# EasyEDA Pro project ProPrj_2024省综合药丸抓取省赛_2025-04-10.epro

# Schematic Schematic1
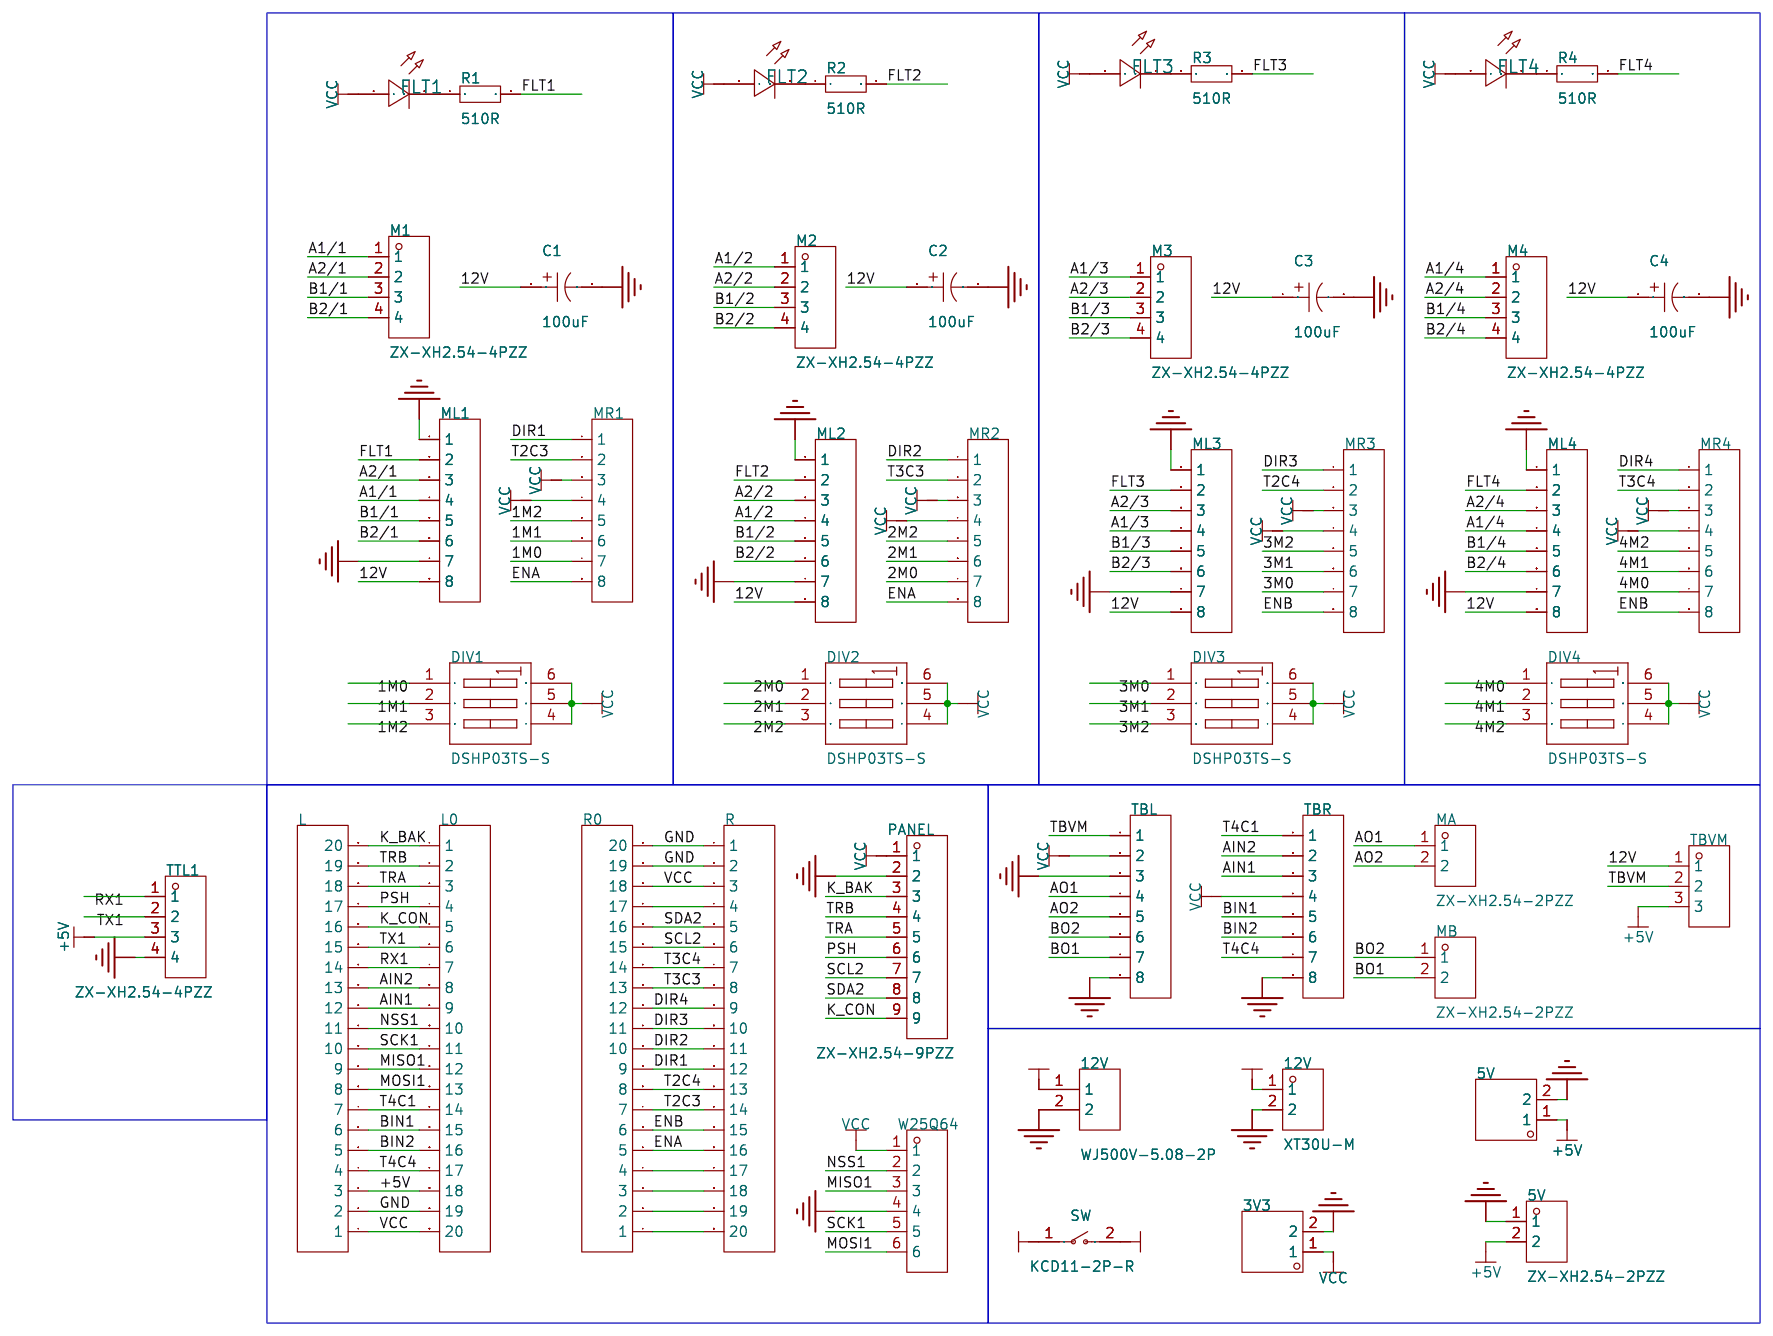
[diagram p0: schematic sheet]

## Parts
3V3  -  [HDR-TH_2P-P2.54-V-M-1]
5V  ZX-XH2.54-2PZZ  [CONN-TH_2P-P2.50_HX25003-2A]
5V#2  -  [HDR-TH_2P-P2.54-V-M-1]
12V  WJ500V-5.08-2P  [CONN-TH_2P-P5.00_WJ500V-5.08-2P]
12V#2  XT30U-M  [CONN-TH_XT30U-M]
C1  100uF  [CAP-SMD_BD6.3-L6.6-W6.6-LS7.6-FD-1]
C2  100uF  [CAP-SMD_BD6.3-L6.6-W6.6-LS7.6-FD-1]
C3  100uF  [CAP-SMD_BD6.3-L6.6-W6.6-LS7.6-FD-1]
C4  100uF  [CAP-SMD_BD6.3-L6.6-W6.6-LS7.6-FD-1]
DIV1  DSHP03TS-S  [SW-SMD_DSHP03TS-S]
DIV2  DSHP03TS-S  [SW-SMD_DSHP03TS-S]
DIV3  DSHP03TS-S  [SW-SMD_DSHP03TS-S]
DIV4  DSHP03TS-S  [SW-SMD_DSHP03TS-S]
FLT1  -  [LED_0603]
FLT2  -  [LED_0603]
FLT3  -  [LED_0603]
FLT4  -  [LED_0603]
L  -  [HDR-TH_20P-P2.54-V-F]
L0  -  [HDR-TH_20P-P2.54-V-F]
M1  ZX-XH2.54-4PZZ  [CONN-TH_4P-P2.50_4PIN]
M2  ZX-XH2.54-4PZZ  [CONN-TH_4P-P2.50_4PIN]
M3  ZX-XH2.54-4PZZ  [CONN-TH_4P-P2.50_4PIN]
M4  ZX-XH2.54-4PZZ  [CONN-TH_4P-P2.50_4PIN]
MA  ZX-XH2.54-2PZZ  [CONN-TH_2P-P2.50_HX25003-2A]
MB  ZX-XH2.54-2PZZ  [CONN-TH_2P-P2.50_HX25003-2A]
ML1  -  [HDR-TH_8P-P2.54-V-F-1]
ML2  -  [HDR-TH_8P-P2.54-V-F-1]
ML3  -  [HDR-TH_8P-P2.54-V-F-1]
ML4  -  [HDR-TH_8P-P2.54-V-F-1]
MR1  -  [HDR-TH_8P-P2.54-V-F-1]
MR2  -  [HDR-TH_8P-P2.54-V-F-1]
MR3  -  [HDR-TH_8P-P2.54-V-F-1]
MR4  -  [HDR-TH_8P-P2.54-V-F-1]
PANEL  ZX-XH2.54-9PZZ  [CONN-TH_9P-P2.50_ZX-XH2.54-9PZZ]
R  -  [HDR-TH_20P-P2.54-V-F]
R0  -  [HDR-TH_20P-P2.54-V-F]
R1  510R  [R0603]
R2  510R  [R0603]
R3  510R  [R0603]
R4  510R  [R0603]
SW  KCD11-2P-R  [SW-TH_2P-L15.0-W10.5-P5.00_KCD11-2P-R]
TBL  -  [HDR-TH_8P-P2.54-V-F-1]
TBR  -  [HDR-TH_8P-P2.54-V-F-1]
TBVM  -  [HDR-TH_3P-P2.54-V-M]
TTL1  ZX-XH2.54-4PZZ  [CONN-TH_4P-P2.50_4PIN]
W25Q64  -  [HDR-TH_6P-P2.54-V-F]

## Library data of the parts
3V3 5V#2 = HDR-M_2.54_1x2P: Supplier Part: C124375; Supplier Footprint: 插件
5V MA MB = ZX-XH2.54-2PZZ: 插针结构:1x2P;间距:2.54mm;安装方式:直插;参考系列:XH;总PIN数:2P;排数:1;每排PIN数:2;行距:-;额定电流:3A;触头材质:黄铜;触头镀层:锡;工作温度范围:-25℃~+85℃;; Supplier Part: C7429632; Manufacturer: Megastar(兆星); Supplier Footprint: 插件,P=2.54mm; JLCPCB Part Class: 扩展库; Datasheet: https://atta.szlcsc.com/upload/public/pdf/source/20230619/19BA6947230AA44A04D3EDD65E618FD0.pdf; Supplier: LCSC; Pins Structure: 1x2P; Pitch: 2.54mm; Mounting Style: 直插; Reference Series: XH; Number of Pins: 2P; Number of Rows: 1; Number of PINs Per Row: 2; Current Rating (Max): 3A; Contact Material: 黄铜; Contact Plating: 锡; Operating Temperature Range: -25℃~+85℃
12V = WJ500V-5.08-2P: 结构:1x2P;间距:5.08mm;颜色:绿色;安装方式:直插;额定电流:18A;额定电压:250V;排数:1;线规 - AWG:14~30;线规 - 平方毫米:2.5;每排PIN数:2;触头材质:-;触头镀层:-;工作温度范围:-40℃~+105℃;焊接温度(最大值):-;; LCSC Part Name: 1x2P 5.08mm 直插 排数:1 每排P数:2; Supplier Part: C8465; Manufacturer: KANGNEX(康奈克斯电气); Supplier Footprint: 插件,P=5.08mm; JLCPCB Part Class: 扩展库; Datasheet: https://atta.szlcsc.com/upload/public/pdf/source/20191225/C8465_02D34CE5B5B4A53DF5891601D97FA9F4.pdf; Supplier: LCSC; Structure: 1x2P; Pitch: 5.08mm; Color: 绿色; Mounting Style: 直插; Current Rating (Max): 18A; Voltage Rating (Max): 250V; Number of Pins: 2P; Number of Rows: 1; Wire Gauge - AWG: 14~30; Wire Gauge - mm2: 2.5; Number of PINs Per Row: 2; Operating Temperature Range: -40℃~+105℃; Screw Specification: M2.5
12V#2 = XT30U-M: 类别:-;类型1:-;; LCSC Part Name: AMASS(艾迈斯)轻量版锂电池插头公头 XT30U-M; Supplier Part: C99101; Manufacturer: AMASS(艾迈斯); JLCPCB Part Class: 扩展库; Datasheet: https://atta.szlcsc.com/upload/public/pdf/source/20170606/1496716542582.pdf; Supplier: LCSC; Brand: 艾迈斯; Type: 插头; Colour: 黄色; InterfaceType: 公头
C1-C4 = RVE100UF35V67RV0072: 容值:100uF;精度:±20%;额定电压:35V;纹波电流:230mA@120Hz;等效串联电阻:600mΩ@100kHz;; LCSC Part Name: 100uF ±20% 35V; Supplier Part: C2836437; Manufacturer: KNSCHA(科尼盛); Supplier Footprint: SMD,D6.3xL7.7mm; JLCPCB Part Class: 扩展库; Datasheet: https://atta.szlcsc.com/upload/public/pdf/source/20220719/B52EB46F8A1558448ED03D8B4CB3C24F.pdf; Supplier: LCSC; Tolerance: ±20%; Rated Voltage: 35V; Ripple Current: 230mA@120Hz; Equivalent Series Resistance(ESR): 600mΩ@100kHz; φD: 6.3mm; L: 7.7mm; Lifetime @ Temp: 2000hrs@105℃; Operating Temperature: -55℃~+105℃
DIV1-DIV4 = DSHP03TS-S: 类型:平拨,凹槽式;电路结构:单刀单掷;开关位数:3位;额定电流:25mA;额定电压:24V;使用寿命:3千次;颜色:黑色;; LCSC Part Name: 间距1.27mm 平拨,凹槽式 3位拨码开关; Supplier Part: C319051; Manufacturer: XKB Connectivity(中国星坤); Supplier Footprint: SMD-6P,5.4x5.4mm; JLCPCB Part Class: 扩展库; Datasheet: https://atta.szlcsc.com/upload/public/pdf/source/20211009/11BE85C99D2C85B0991AF4F9D6EB8BDE.pdf; Supplier: LCSC; Type: 平拨,凹槽式; Circuit: 单刀单掷; Number of Positions: 3位; Pin Style: 鸥翼型; Lead Pitch: 1.27mm; Current Rating: 25mA; Voltage Rating: 24V; Operating Temperature: -20℃~+70℃; Operating Life: 3千次; Color: 黑色
FLT1-FLT4 = LED_0603-R: Supplier Footprint: 0603
L L0 R R0 = HDR-F_2.54_1x20P: Supplier Part: C50984; Supplier Footprint: 插件
M1-M4 TTL1 = ZX-XH2.54-4PZZ: 插针结构:1x4P;间距:2.54mm;安装方式:直插;参考系列:XH;总PIN数:4P;排数:1;每排PIN数:4;行距:-;额定电流:3A;触头材质:黄铜;触头镀层:锡;工作温度范围:-25℃~+85℃;; Supplier Part: C7429634; Manufacturer: Megastar(兆星); Supplier Footprint: 插件,P=2.54mm; JLCPCB Part Class: 扩展库; Datasheet: https://atta.szlcsc.com/upload/public/pdf/source/20230619/B529A2163E0159A644AB3383D208FB03.pdf; Supplier: LCSC; Pins Structure: 1x4P; Pitch: 2.54mm; Mounting Style: 直插; Reference Series: XH; Number of Pins: 4P; Number of Rows: 1; Number of PINs Per Row: 4; Current Rating (Max): 3A; Contact Material: 黄铜; Contact Plating: 锡; Operating Temperature Range: -25℃~+85℃
ML1-ML4 MR1-MR4 TBL TBR = HDR-F_2.54_1x8P: Supplier Part: C27438; Supplier Footprint: 插件
PANEL = ZX-XH2.54-9PZZ: 插针结构:1x9P;间距:2.54mm;安装方式:直插;参考系列:XH;总PIN数:9P;排数:1;每排PIN数:9;行距:-;额定电流:3A;触头材质:黄铜;触头镀层:锡;工作温度范围:-25℃~+85℃;; Supplier Part: C7429639; Manufacturer: Megastar(兆星); Supplier Footprint: 插件,P=2.54mm; JLCPCB Part Class: 扩展库; Datasheet: https://atta.szlcsc.com/upload/public/pdf/source/20230619/A41EC9057C60B306F9C507100E2CF652.pdf; Supplier: LCSC; Pins Structure: 1x9P; Pitch: 2.54mm; Mounting Style: 直插; Reference Series: XH; Number of Pins: 9P; Number of Rows: 1; Number of PINs Per Row: 9; Current Rating (Max): 3A; Contact Material: 黄铜; Contact Plating: 锡; Operating Temperature Range: -25℃~+85℃
R1-R4 = Res_0603: Supplier Footprint: 0603
SW = KCD11-2P-R: 带灯:无;引脚样式:焊片;额定电流:3A;额定电压(AC):250V;额定电压(DC):-;电路结构:单刀单掷;机械寿命:1万次;; LCSC Part Name: 10.5*15mm 两脚两档跷板开关 红钮; Supplier Part: C5884414; Manufacturer: SHOU HAN(首韩); Supplier Footprint: 插件; JLCPCB Part Class: 扩展库; Datasheet: https://atta.szlcsc.com/upload/public/pdf/source/20230506/CD06DFDE35C8048D34175BFF4AF6A2C2.pdf; Supplier: LCSC; Switch Length: 15mm; Switch Width: 10.5mm; Switch Height: 17.2mm; Actuator Type: 凹面弯曲; With Lamp: 无; Pin Style: 焊片; Actuator Color: 红色; Contact Current: 3A; Voltage Rating (AC): 250V; Circuit: 单刀单掷; Mechanical Life: 1万次; Operating Temperature: 0℃~+125℃; Actuator Identifier: - O
TBVM = HDR-M_2.54_1x3P: Supplier Part: C2937625; Supplier Footprint: 插件
W25Q64 = HDR-F_2.54_1x6P: Supplier Part: C40877; Supplier Footprint: 插件

## Nets
12V: C1.1 C2.1 C3.1 C4.1 ML1.8 ML2.8 ML3.8 ML4.8 SW.1 TBVM.1
+5V: 5V.2 5V#2.1 L.3 L0.18 TBVM.3 TTL1.3
GND: 3V3.2 5V.1 5V#2.2 12V.2 12V#2.2 C1.2 C2.2 C3.2 C4.2 L.2 L0.19 ML1.1 ML1.7 ML2.1 ML2.7 ML3.1 ML3.7 ML4.1 ML4.7 PANEL.2 R.1 R.2 R0.19 R0.20 TBL.3 TBL.8 TBR.8 TTL1.4 W25Q64.4
VCC: 3V3.1 DIV1.4 DIV1.5 DIV1.6 DIV2.4 DIV2.5 DIV2.6 DIV3.4 DIV3.5 DIV3.6 DIV4.4 DIV4.5 DIV4.6 FLT1.2(A) FLT2.2(A) FLT3.2(A) FLT4.2(A) L.1 L0.20 MR1.3 MR1.4 MR2.3 MR2.4 MR3.3 MR3.4 MR4.3 MR4.4 PANEL.1 R.3 R0.18 TBL.2 TBR.4 W25Q64.1
1M0: DIV1.1 MR1.7
1M1: DIV1.2 MR1.6
1M2: DIV1.3 MR1.5
2M0: DIV2.1 MR2.7
2M1: DIV2.2 MR2.6
2M2: DIV2.3 MR2.5
3M0: DIV3.1 MR3.7
3M1: DIV3.2 MR3.6
3M2: DIV3.3 MR3.5
4M0: DIV4.1 MR4.7
4M1: DIV4.2 MR4.6
4M2: DIV4.3 MR4.5
A1/1: M1.1 ML1.4
A1/2: M2.1 ML2.4
A1/3: M3.1 ML3.4
A1/4: M4.1 ML4.4
A2/1: M1.2 ML1.3
A2/2: M2.2 ML2.3
A2/3: M3.2 ML3.3
A2/4: M4.2 ML4.3
AIN1: L.12 L0.9 TBR.3
AIN2: L.13 L0.8 TBR.2
AO1: MA.1 TBL.4
AO2: MA.2 TBL.5
B1/1: M1.3 ML1.5
B1/2: M2.3 ML2.5
B1/3: M3.3 ML3.5
B1/4: M4.3 ML4.5
B2/1: M1.4 ML1.6
B2/2: M2.4 ML2.6
B2/3: M3.4 ML3.6
B2/4: M4.4 ML4.6
BIN1: L.6 L0.15 TBR.5
BIN2: L.5 L0.16 TBR.6
BO1: MB.2 TBL.7
BO2: MB.1 TBL.6
DIR1: MR1.1 R.12 R0.9
DIR2: MR2.1 R.11 R0.10
DIR3: MR3.1 R.10 R0.11
DIR4: MR4.1 R.9 R0.12
ENA: MR1.8 MR2.8 R.16 R0.5
ENB: MR3.8 MR4.8 R.15 R0.6
FLT1: ML1.2 R1.2
FLT2: ML2.2 R2.2
FLT3: ML3.2 R3.2
FLT4: ML4.2 R4.2
K_BAK: L.20 L0.1 PANEL.3
K_CON: L.16 L0.5 PANEL.9
MISO1: L.9 L0.12 W25Q64.3
MOSI1: L.8 L0.13 W25Q64.6
MV: 12V.1 12V#2.1 SW.2
NSS1: L.11 L0.10 W25Q64.2
PSH: L.17 L0.4 PANEL.6
RX1: L.14 L0.7 TTL1.1
SCK1: L.10 L0.11 W25Q64.5
SCL2: PANEL.7 R.6 R0.15
SDA2: PANEL.8 R.5 R0.16
T2C3: MR1.2 R.14 R0.7
T2C4: MR3.2 R.13 R0.8
T3C3: MR2.2 R.8 R0.13
T3C4: MR4.2 R.7 R0.14
T4C1: L.7 L0.14 TBR.1
T4C4: L.4 L0.17 TBR.7
TBVM: TBL.1 TBVM.2
TRA: L.18 L0.3 PANEL.5
TRB: L.19 L0.2 PANEL.4
TX1: L.15 L0.6 TTL1.2
$1N791: R.4 R0.17
$1N817: R.17 R0.4
$1N819: R.18 R0.3
$1N821: R.19 R0.2
$1N823: R.20 R0.1
$1N12146: FLT1.1(C) R1.1
$1N12296: FLT2.1(C) R2.1
$1N12394: FLT3.1(C) R3.1
$1N12492: FLT4.1(C) R4.1

# Board OPENMV
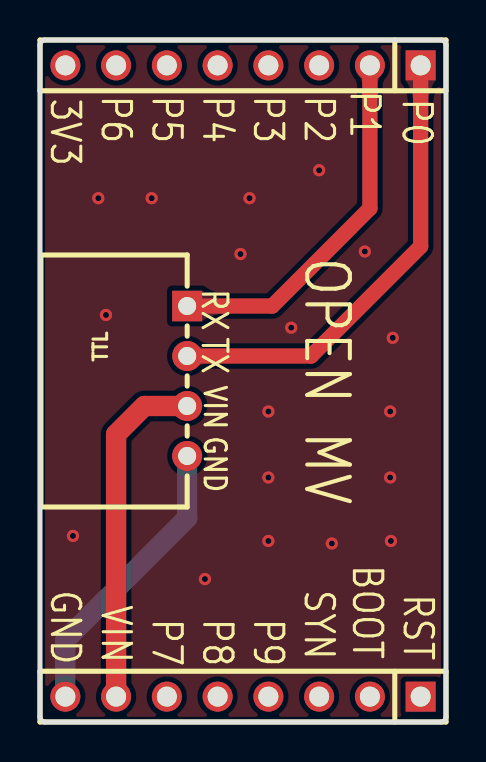
[diagram p1: board, top side]
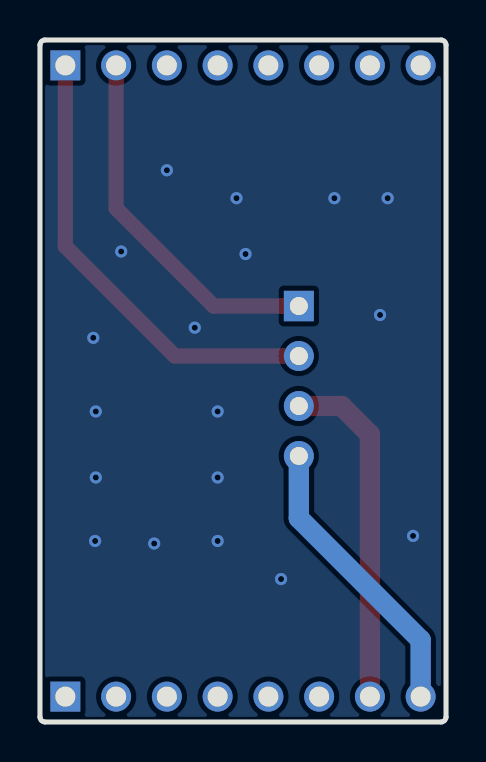
[diagram p2: board, bottom side, seen from below]

Outline 20.32 x 34.11 mm; copper layers: Top Layer, Bottom Layer. Coordinates in mm from the lower left corner of the outline.
Outline path: 0,33.86 0,0.25 arc(0.07,0.07) 0.25,0 20.07,0 arc(20.25,0.07) 20.32,0.25 20.32,33.86 arc(20.25,34.04) 20.07,34.11 0.25,34.11 arc(0.07,34.04) 0,33.86
Stack: Top Layer 0.035mm / Dielectric1 1.51mm FR4 er 4.5 / Bottom Layer 0.035mm

## Design rules (mm)
template: JLCPCB Capability(Two Layers Board)
spacing copperThickness1oz (default): track to track 0.102, other pairs 0.152 to 0.3
spacing copperThickness2oz: track to track 0.203, other pairs 0.152 to 0.3
track width copperThickness1oz (default): min 0.127, default 0.254, max 2.54
track width copperThickness2oz: min 0.203, default 0.254, max 2.54
differential pair differentialPair (default): width min 0.127, default 0.254, max 2.54; gap min 0.152, default 0.152
via viaSize (default): diameter min 0.5, default 0.61, max 10; hole min 0.3, default 0.305, max 6.3

## Placement (name value [footprint] x y rotation side)
L1  -  [HDR-TH_8P-P2.54-V-M]  10.16 32.84 180 top
R1  -  [HDR-TH_8P-P2.54-V-M]  10.16 1.27 180 top
TTL  ZX-XH2.54-4PWZ  [CONN-TH_4P-P2.50_ZX-XH2.54-4PWZ]  7.37 17.06 270 top

## Footprints (pads in the part's own frame, mm; a bottom-side part is the same pattern mirrored in y, then rotated)
CONN-TH_4P-P2.50_ZX-XH2.54-4PWZ
  rect 1.524x1.5 hole 0.9: 1(-3.75,0)
  round 1.5 hole 0.9: 2(-1.25,0) 3(1.25,0) 4(3.75,0)
HDR-TH_8P-P2.54-V-M
  rect 1.5x1.5 hole 1: 1(-8.89,0)
  round 1.5 hole 1: 2(-6.35,0) 3(-3.81,0) 4(-1.27,0) 5(1.27,0) 6(3.81,0) 7(6.35,0) 8(8.89,0)

## Nets
GND1: R1.8 TTL.4
VIN1: R1.7 TTL.3
P0: L1.1 TTL.2
P1: L1.2 TTL.1

Pads without a net: L1 3 4 5 6 7 8; R1 1 2 3 4 5 6

## Via types
v1: diameter 0.61, hole 0.305, Top Layer to Bottom Layer, 18 vias

## Routing (per net, layer and track width the routed paths; a pad name or vN(x,y) marks a point on that pad's centre or on a via; arc(x,y) is an arc through that point)
GND1: length 14.6
  Bottom Layer w1.016: R1.8 1.27,4.1 7.37,10.2 TTL.4
VIN1: length 17.3
  Top Layer w1.016: R1.7 3.81,14.39 5.23,15.81 TTL.3
1-2:
  vias: v1(1.65,9.31) v1(2.92,26.2) v1(3.3,20.36) v1(5.59,26.2) v1(8.25,7.15) v1(10.03,23.41) v1(10.49,26.2) v1(11.43,15.53) v1(11.43,12.23) v1(11.43,9.05) v1(12.57,19.72) v1(13.97,27.6) v1(14.6,8.93) v1(16.26,23.53) v1(17.53,15.53) v1(17.53,12.23) v1(17.56,9.05) v1(17.65,19.21)
P0: length 23
  Top Layer w0.762: TTL.2 13.57,18.31 19.05,23.79 L1.1
P1: length 18.3
  Top Layer w0.762: L1.2 16.51,25.69 11.62,20.81 TTL.1

## Copper pours and planes (outline as drawn; the poured copper is in the pictures)
1-2 on Top Layer: -0.89,34.71 20.57,34.71 20.57,-1.23 -0.89,-1.23
1-2 on Bottom Layer: -0.89,34.71 20.57,34.71 20.57,-1.23 -0.89,-1.23

Small or netless copper shapes (teardrops, artwork), in the pictures only: 6 on Top Layer, 2 on Bottom Layer

## Text on the board
Top Silkscreen Layer: GND | VIN | TX | RX | P0 | 3V3 | P6 | P5 | P7 | P4 | P8 | P9 | SYN | P1 | BOOT | RST | P3 | P2 | OPEN MV

# Board STM32
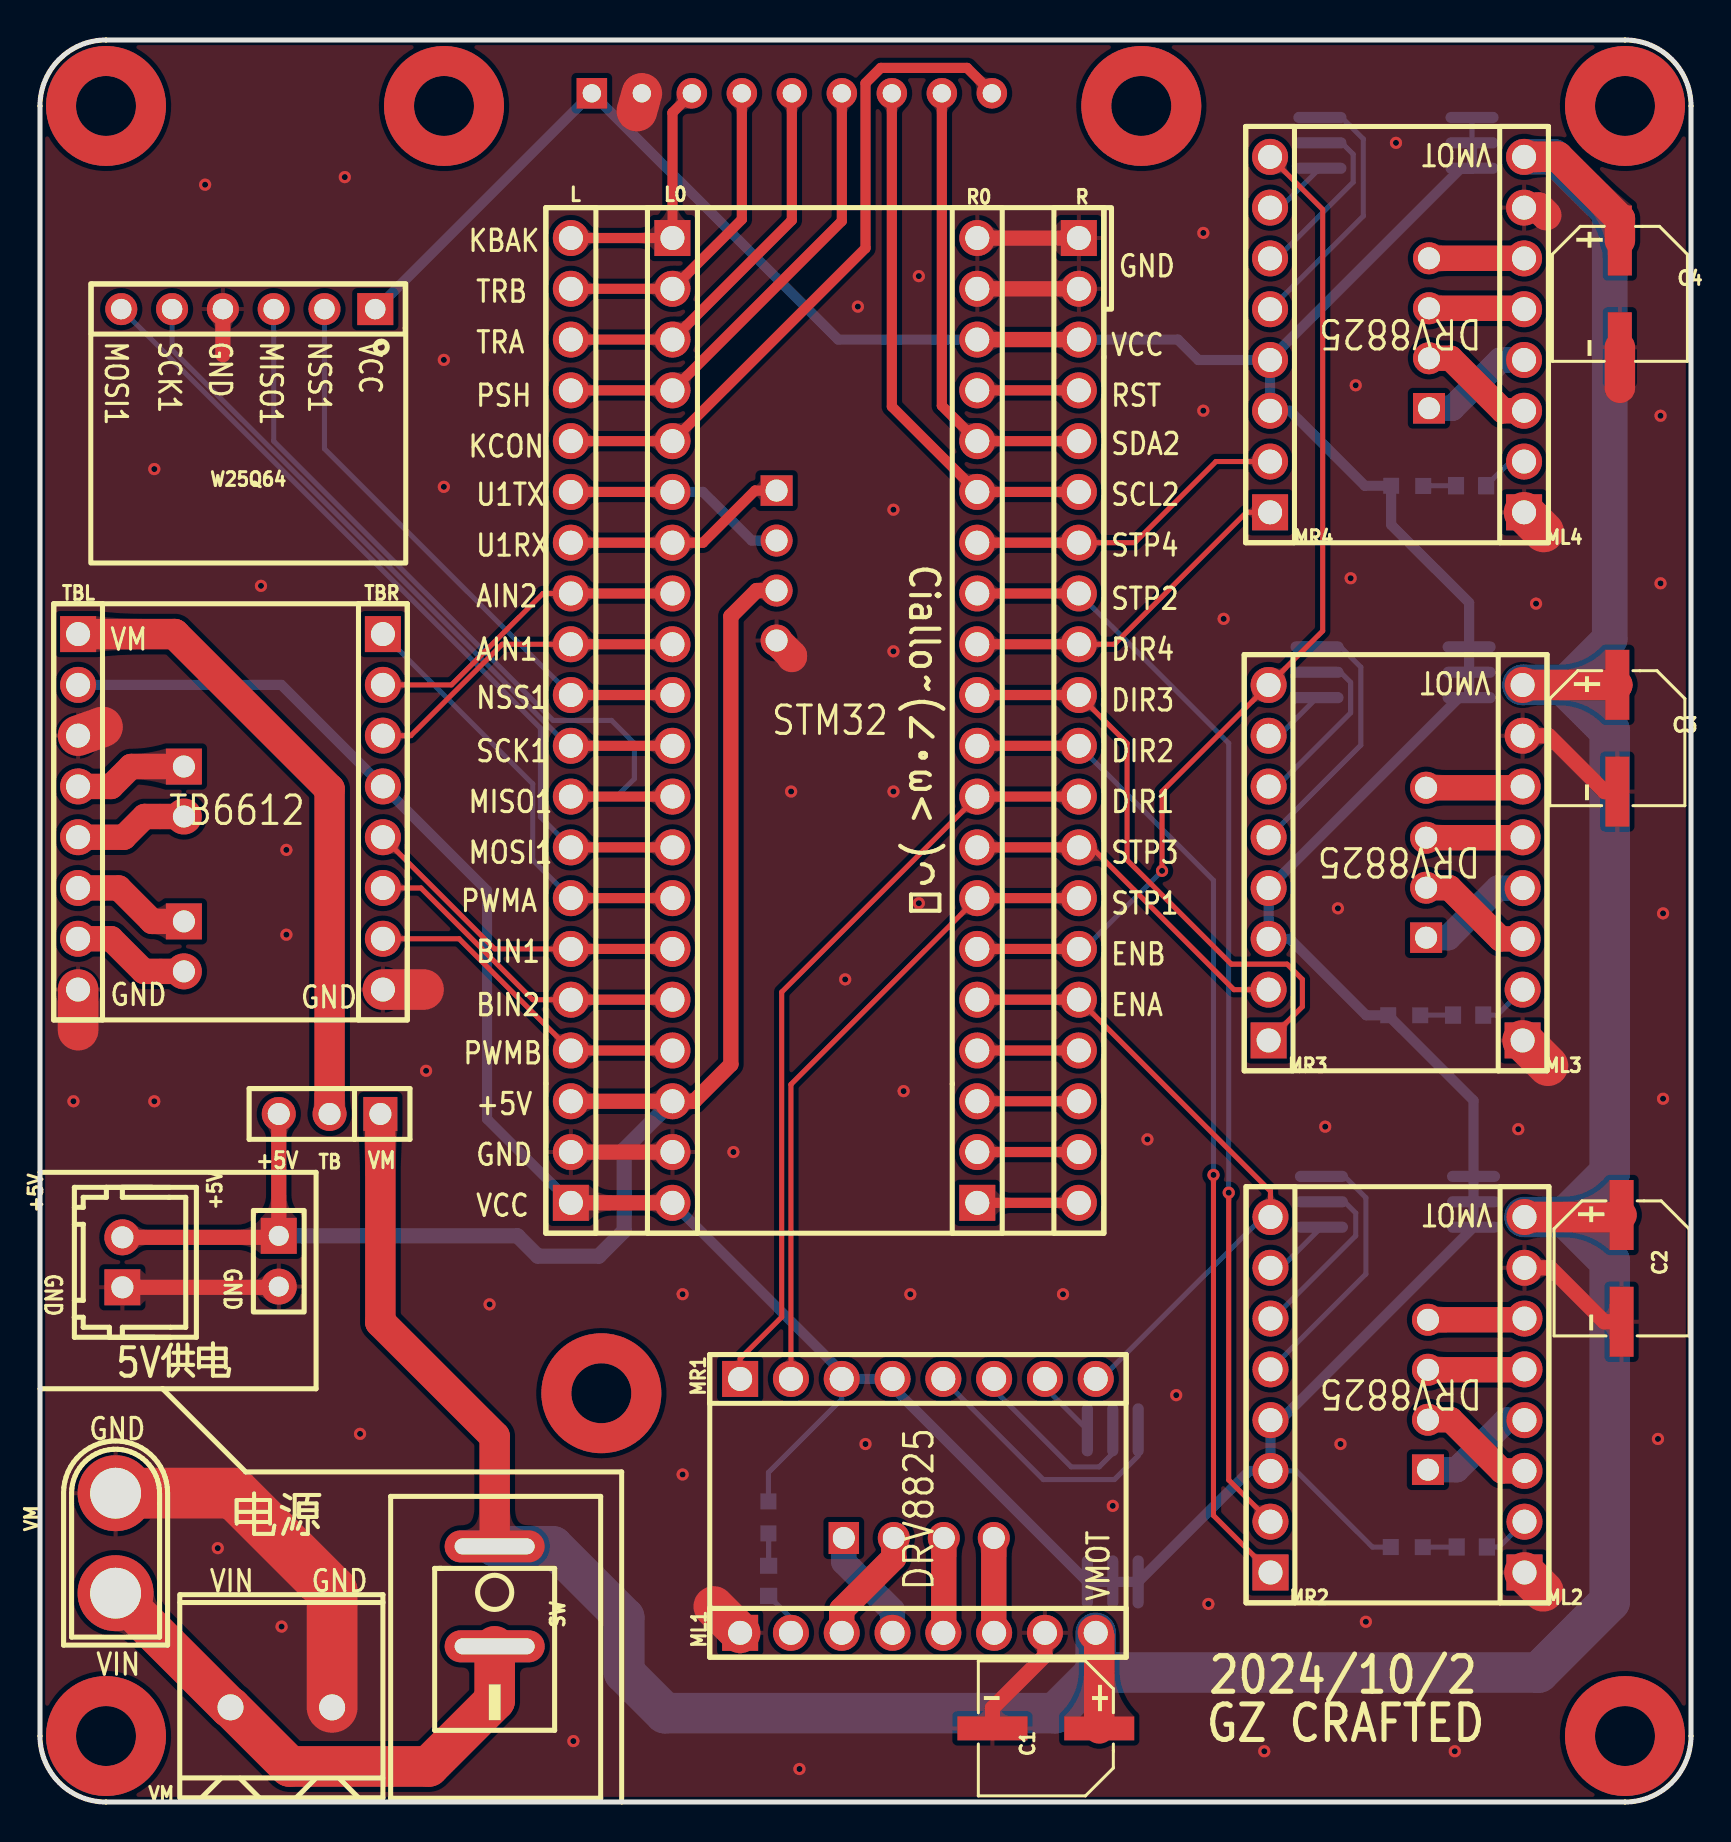
[diagram p3: board, top side]
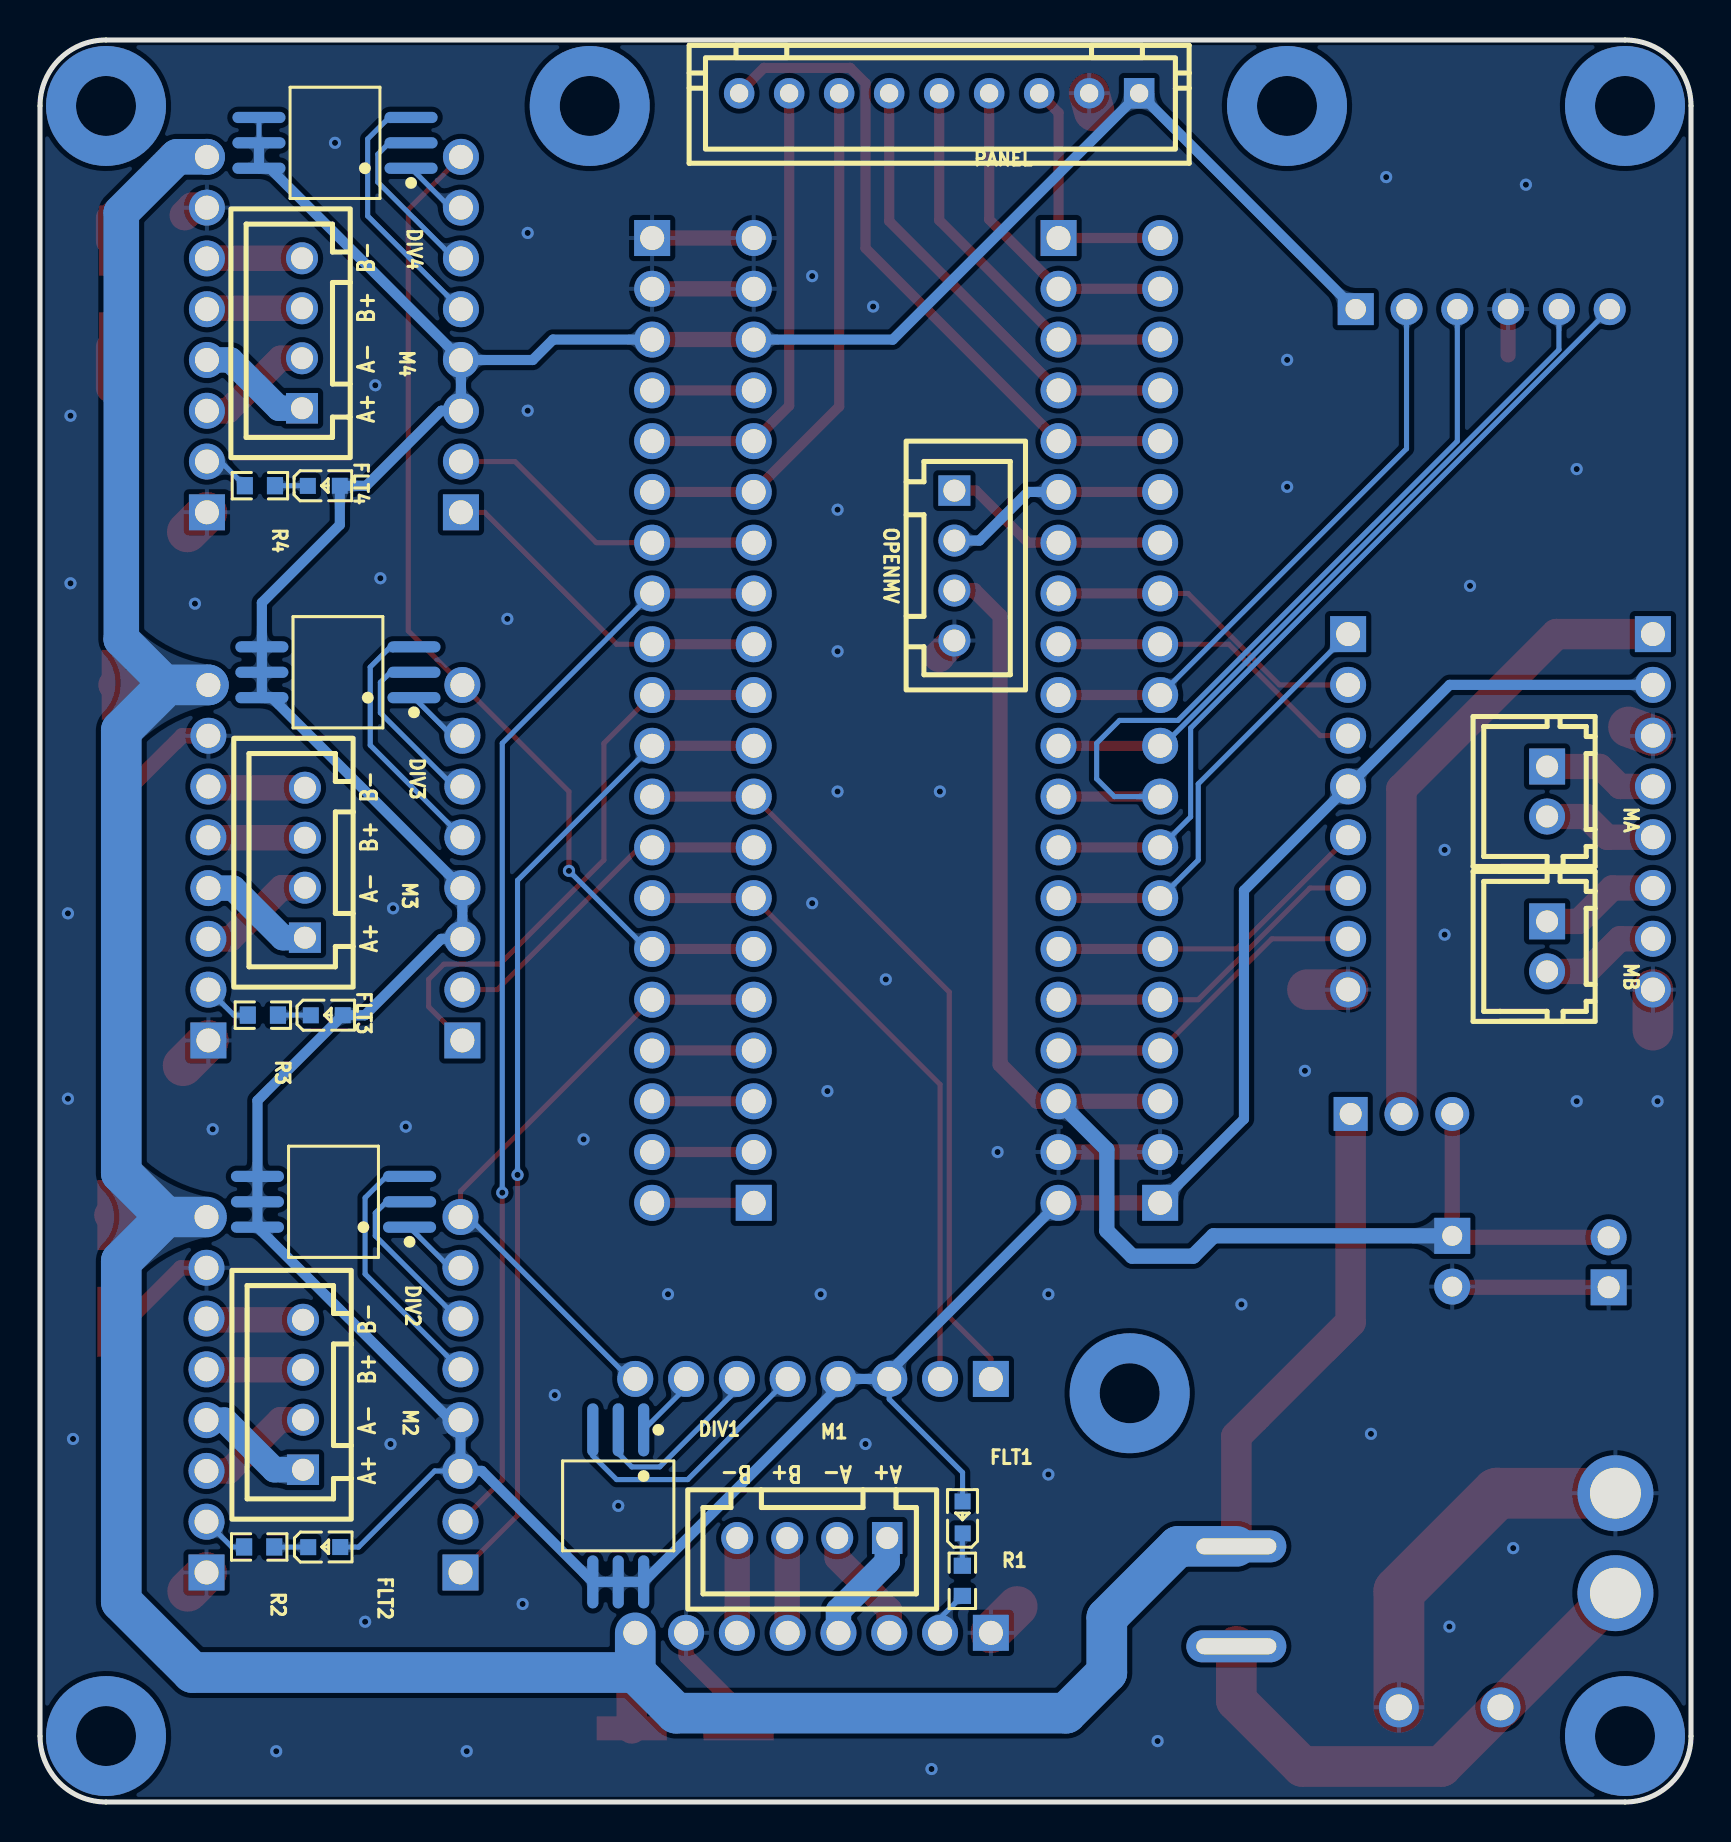
[diagram p4: board, bottom side, seen from below]

Outline 82.55 x 88.14 mm; copper layers: Top Layer, Bottom Layer. Coordinates in mm from the lower left corner of the outline.
Outline path: 0,84.84 0,3.3 arc(0.97,0.97) 3.3,0 79.25,0 arc(81.58,0.97) 82.55,3.3 82.55,84.84 arc(81.58,87.17) 79.25,88.14 3.3,88.14 arc(0.97,87.17) 0,84.84
Stack: Top Layer 0.035mm / Dielectric1 1.51mm FR4 er 4.5 / Bottom Layer 0.035mm

## Design rules (mm)
template: JLCPCB Capability(Two Layers Board)
spacing copperThickness1oz (default): track to track 0.102, other pairs 0.152 to 0.3
spacing copperThickness2oz: track to track 0.203, other pairs 0.152 to 0.3
track width copperThickness1oz (default): min 0.127, default 0.254, max 2.54
track width copperThickness2oz: min 0.203, default 0.254, max 2.54
differential pair differentialPair (default): width min 0.127, default 0.254, max 2.54; gap min 0.152, default 0.152
via viaSize (default): diameter min 0.5, default 0.61, max 10; hole min 0.3, default 0.305, max 6.3

## Placement (name value [footprint] x y rotation side)
+5V  -  [CONN-TH_2P-P2.50_HX25003-2A]  4.12 27 90 top
+5V#2  -  [HDR-TH_2P-P2.54-V-M-1]  11.94 27.05 270 top
C1  100uF  [CAP-SMD_BD6.3-L6.6-W6.6-LS7.6-FD-1]  50.29 3.68 180 top
C2  100uF  [CAP-SMD_BD6.3-L6.6-W6.6-LS7.6-FD-1]  79.08 26.69 270 top
C3  100uF  [CAP-SMD_BD6.3-L6.6-W6.6-LS7.6-FD-1]  78.87 53.21 270 top
C4  100uF  [CAP-SMD_BD6.3-L6.6-W6.6-LS7.6-FD-1]  78.99 75.44 270 top
DIV1  DSHP03TS-S  [SW-SMD_DSHP03TS-S]  53.64 14.81 0 bottom
DIV2  DSHP03TS-S  [SW-SMD_DSHP03TS-S]  67.87 30.02 90 bottom
DIV3  DSHP03TS-S  [SW-SMD_DSHP03TS-S]  67.65 56.51 90 bottom
DIV4  DSHP03TS-S  [SW-SMD_DSHP03TS-S]  67.8 82.99 90 bottom
FLT1  -  [LED_0603]  36.43 14.29 90 bottom
FLT2  -  [LED_0603]  68.29 12.76 180 bottom
FLT3  -  [LED_0603]  68.16 39.36 180 bottom
FLT4  -  [LED_0603]  68.31 65.84 180 bottom
L  -  [HDR-TH_20P-P2.54-V-F]  26.54 54.1 90 top
L0  -  [HDR-TH_20P-P2.54-V-F]  31.62 54.1 270 top
M1  ZX-XH2.54-4PZZ  [CONN-TH_4P-P2.50_4PIN]  43.94 13.21 0 bottom
M2  ZX-XH2.54-4PZZ  [CONN-TH_4P-P2.50_4PIN]  69.4 20.37 90 bottom
M3  ZX-XH2.54-4PZZ  [CONN-TH_4P-P2.50_4PIN]  69.31 46.98 90 bottom
M4  ZX-XH2.54-4PZZ  [CONN-TH_4P-P2.50_4PIN]  69.45 73.47 90 bottom
MA  ZX-XH2.54-2PZZ  [CONN-TH_2P-P2.50_HX25003-2A]  7.19 50.55 270 bottom
MB  ZX-XH2.54-2PZZ  [CONN-TH_2P-P2.50_HX25003-2A]  7.19 42.8 270 bottom
ML1  -  [HDR-TH_8P-P2.54-V-F-1]  43.9 8.46 0 top
ML2  -  [HDR-TH_8P-P2.54-V-F-1]  74.22 20.37 90 top
ML3  -  [HDR-TH_8P-P2.54-V-F-1]  74.13 46.98 90 top
ML4  -  [HDR-TH_8P-P2.54-V-F-1]  74.2 73.4 90 top
MR1  -  [HDR-TH_8P-P2.54-V-F-1]  43.9 21.16 0 top
MR2  -  [HDR-TH_8P-P2.54-V-F-1]  61.52 20.37 90 top
MR3  -  [HDR-TH_8P-P2.54-V-F-1]  61.43 46.98 90 top
MR4  -  [HDR-TH_8P-P2.54-V-F-1]  61.5 73.4 90 top
OPENMV  ZX-XH2.54-4PZZ  [CONN-TH_4P-P2.50_4PIN]  36.83 61.85 270 bottom
PANEL  ZX-XH2.54-9PZZ  [CONN-TH_9P-P2.50_ZX-XH2.54-9PZZ]  37.59 85.47 0 bottom
R  -  [HDR-TH_20P-P2.54-V-F]  51.94 54.1 270 top
R0  -  [HDR-TH_20P-P2.54-V-F]  46.86 54.1 90 top
R1  510R  [R0603]  36.43 11.06 270 bottom
R2  510R  [R0603]  71.59 12.76 0 bottom
R3  510R  [R0603]  71.41 39.36 0 bottom
R4  510R  [R0603]  71.56 65.84 0 bottom
SW  KCD11-2P-R  [SW-TH_2P-L15.0-W10.5-P5.00_KCD11-2P-R]  22.73 10.29 270 top
TB  -  [HDR-TH_3P-P2.54-V-M]  14.48 34.42 180 top
TBL  -  [HDR-TH_8P-P2.54-V-F-1]  1.91 49.53 270 top
TBR  -  [HDR-TH_8P-P2.54-V-F-1]  17.14 49.53 270 top
VM  -  [CONN-TH_XT30U-M]  3.78 12.95 90 top
VM#2  -  [CONN-TH_2P-P5.00_WJ500V-5.08-2P]  12.07 4.73 0 top
W25Q64  -  [HDR-TH_6P-P2.54-V-F]  10.41 74.68 180 top

## Footprints (pads in the part's own frame, mm; a bottom-side part is the same pattern mirrored in y, then rotated)
CAP-SMD_BD6.3-L6.6-W6.6-LS7.6-FD-1
  rect 3.5x1.2 smd: 1(-2.67,0) 2(2.67,0)
CONN-TH_2P-P2.50_HX25003-2A
  rect 1.8x1.8 hole 1.1: 1(-1.25,0)
  round 1.8 hole 1.1: 2(1.25,0)
CONN-TH_2P-P5.00_WJ500V-5.08-2P
  round 2 hole 1.3: 1(-2.54,0) 2(2.54,0)
CONN-TH_4P-P2.50_4PIN
  rect 1.524x1.6 hole 1.1: 1(-3.75,0)
  round 1.6 hole 1.1: 2(-1.25,0) 3(1.25,0) 4(3.75,0)
CONN-TH_9P-P2.50_ZX-XH2.54-9PZZ
  rect 1.524x1.524 hole 0.914: 1(-10,0)
  round 1.524 hole 0.914: 2(-7.5,0) 3(-5,0) 4(-2.5,0) 5(0,0) 6(2.5,0) 7(5,0) 8(7.5,0) 9(10,0)
CONN-TH_XT30U-M
  round 3.8 hole 2.54: 1(-2.5,0) 2(2.5,0)
HDR-TH_2P-P2.54-V-M-1
  rect 1.8x1.8 hole 1: 1(-1.27,0)
  round 1.8 hole 1: 2(1.27,0)
HDR-TH_3P-P2.54-V-M
  rect 1.7x1.7 hole 1.1: 1(-2.54,0)
  round 1.7 hole 1.1: 2(0,0) 3(2.54,0)
HDR-TH_6P-P2.54-V-F
  rect 1.8x1.6 hole 1.02: 1(-6.35,0)
  round 1.6 hole 1.02: 2(-3.81,0) 3(-1.27,0) 4(1.27,0) 5(3.81,0) 6(6.35,0)
HDR-TH_8P-P2.54-V-F-1
  rect 1.8x1.8 hole 1.2: 1(-8.89,0)
  round 1.8 hole 1.2: 2(-6.35,0) 3(-3.81,0) 4(-1.27,0) 5(1.27,0) 6(3.81,0) 7(6.35,0) 8(8.89,0)
HDR-TH_20P-P2.54-V-F
  rect 1.8x1.8 hole 1.2: 1(-24.13,0)
  round 1.8 hole 1.2: 2(-21.59,0) 3(-19.05,0) 4(-16.51,0) 5(-13.97,0) 6(-11.43,0) 7(-8.89,0) 8(-6.35,0) 9(-3.81,0) 10(-1.27,0) 11(1.27,0) 12(3.81,0) 13(6.35,0) 14(8.89,0) 15(11.43,0) 16(13.97,0) 17(16.51,0) 18(19.05,0) 19(21.59,0) 20(24.13,0)
LED_0603
  rect 0.8x0.8 smd: 1(-0.851,-0.01) 2(0.75,-0.005)
R0603
  rect 0.806x0.864 smd: 1(-0.753,0) 2(0.753,0)
SW-SMD_DSHP03TS-S
  oval 0.56x2.655 smd: 1(-1.27,-3.803) 2(0,-3.803) 3(1.27,-3.803) 4(1.27,3.803) 5(0,3.803) 6(-1.27,3.803)
SW-TH_2P-L15.0-W10.5-P5.00_KCD11-2P-R
  oval 1.6x5 hole 0.8x4: 1(-2.5,0) 2(2.5,0)

## Nets
As in the schematic, except:
12V: C1.1 C2.1 C3.1 C4.1 ML1.8 ML2.8 ML3.8 ML4.8 SW.1 TB.1
+5V: +5V.2 +5V#2.1 L.3 L0.18 OPENMV.3 TB.3
GND: +5V.1 +5V#2.2 C1.2 C2.2 C3.2 C4.2 L.2 L0.19 ML1.1 ML1.7 ML2.1 ML2.7 ML3.1 ML3.7 ML4.1 ML4.7 OPENMV.4 PANEL.2 R.1 R.2 R0.19 R0.20 TBL.3 TBL.8 TBR.8 VM.2 VM#2.2 W25Q64.4
MV: SW.2 VM.1 VM#2.1
RX1: L.14 L0.7 OPENMV.1
TBVM: TB.2 TBL.1
TX1: L.15 L0.6 OPENMV.2

## Via types
v1: diameter 6, hole 3, Top Layer to Bottom Layer, 7 vias
v2: diameter 0.61, hole 0.305, Top Layer to Bottom Layer, 58 vias

## Routing (per net, layer and track width the routed paths; a pad name or vN(x,y) marks a point on that pad's centre or on a via; arc(x,y) is an arc through that point)
12V: length 193.5
  Top Layer w1.524: TB.1 17.02,24 22.73,18.29 SW.1 ; C3.1 78.86,55.88 ML3.8 ; ML1.8 52.96,8.29 C1.1 ; ML4.8 75.89,82.3 78.99,79.2 C4.1 ; 79.08,29.36 78.98,29.26 ML2.8
  Bottom Layer w1.778: 74.2,82.3 75.69,82.3 78.49,79.5 78.49,58.17 76.2,55.88
  Bottom Layer w2.032: 52.79,6.48 74.93,6.48 78.49,10.03 78.49,27.05 76.28,29.26 ; 52.79,6.48 ML1.8 ; 52.79,6.48 50.75,4.44 31.24,4.44 29.21,6.48 29.21,9.22 25.65,12.79 SW.1 ; 76.28,29.26 ML2.8 ; 76.28,29.26 78.49,31.47 78.49,53.59 76.2,55.88 74.14,55.88 ML3.8
+5V: length 73.6
  Top Layer w0.762: OPENMV.3 35.83,60.6 34.54,59.31 34.54,36.9 32.7,35.05 L0.18 L.3 ; TB.3 +5V#2.1 11.86,28.25 +5V.2
  Bottom Layer w0.762: L0.18 29.21,32.64 29.21,28.58 27.94,27.31 24.89,27.31 23.88,28.32 +5V#2.1
GND: length 78.9
  Top Layer w0.762: W25Q64.4 9.14,72.39 ; +5V.1 11.9,25.75 +5V#2.2 ; ML2.7 75.51,26.72 78.21,24.02 79.08,24.02 ; R0.19 R.2 ; ML1.7 50.25,7.32 47.62,4.7 C1.2 ; R0.20 R.1 ; C3.2 78.24,50.54 75.44,53.34 ML3.7 ; ML1.1 34.93,8.38 ; L.2 L0.19
  Top Layer w1.524: ML4.7 74.94,79.75 75.31,79.38 ; OPENMV.4 37.59,57.34 37.59,57.28 ; C4.2 78.99,70.74
  Top Layer w2.032: TBL.3 3.12,53.78 ; ML1.1 33.69,9.78 ; PANEL.2 29.84,84.58 ; ML3.1 75.4,36.83 ; ML2.1 75.16,10.54 ; TBL.8 1.91,38.61 ; TBR.8 19.18,40.64 ; ML4.1 75.18,63.53
  Top Layer w2.54: VM#2.2 14.61,10.54 9.7,15.45 VM.2
  vias: v2(1.67,35.05) v2(5.72,66.68) v2(5.72,35.05) v2(8.25,80.9) v2(8.89,12.7) v2(11.05,60.83) v2(12.08,8.77) v2(12.32,47.62) v2(12.32,43.39) v2(15.24,81.28) v2(16,18.41) v2(19.3,36.58) v2(20.19,72.14) v2(20.19,65.79) v2(22.48,24.89) v2(26.67,3.05) v2(32.13,25.4) v2(32.13,16.38) v2(34.67,32.51) v2(37.56,50.55) v2(37.97,1.65) v2(40.26,41.15) v2(40.89,74.8) v2(41.28,17.91) v2(42.67,64.64) v2(42.67,57.56) v2(42.67,50.55) v2(43.18,35.56) v2(43.52,25.4) v2(43.94,76.33) v2(43.94,44.96) v2(51.15,25.4) v2(53.64,14.81) v2(55.37,33.15) v2(56.81,20.35) v2(58.17,78.49) v2(58.17,69.6) v2(58.42,9.91) v2(59.18,59.18) v2(61.21,2.54) v2(64.26,33.78) v2(64.9,44.7) v2(65.02,17.91) v2(65.53,61.21) v2(65.79,70.87) v2(66.29,9.02) v2(67.8,82.99) v2(70.74,2.54) v2(73.91,33.66) v2(74.8,59.94) v2(80.9,18.16) v2(81.03,69.34) v2(81.03,60.96) v2(81.15,44.45) v2(81.15,35.18)
VCC: length 249.7
  Top Layer w0.762: L.1 L0.20 ; R0.18 R.3
  Bottom Layer w0.254: MR2.3 62.81,16.56 66.62,12.75 67.54,12.75 ; FLT1.2 36.42,16.48 40.09,20.15 MR1.3 ; DIV4.4 DIV4.5
  Bottom Layer w0.508: R0.18 39.91,73.15 PANEL.1 16.8,74.68 W25Q64.1 ; 61.5,72.13 61.5,72.17 71.05,81.72 DIV4.6 DIV4.5 ; 61.5,72.13 57.92,72.13 56.9,73.15 R.3 ; 61.5,72.13 MR4.3 62.49,69.59 66.24,65.84 FLT4.2 67.56,63.89 71.46,59.99 DIV3.4 DIV3.5 DIV3.6 70.96,55.24 MR3.4 MR3.3 62.49,43.18 66.31,39.36 FLT3.2 71.68,35.09 71.68,28.75 62.03,19.1 MR2.4 MR2.3 60.46,16.56 DIV1.4 DIV1.5 DIV1.6 42.63,20.75 MR1.4 MR1.3 40.09,21.51 L0.20 ; L.1 22.35,34.16 22.35,45.59 TBR.4 12.06,55.88 TBL.2
(no net):
  vias: v1(3.3,84.84) v1(3.3,3.3) v1(20.2,84.84) v1(28.07,20.45) v1(55.06,84.84) v1(79.25,84.84) v1(79.25,3.3)
1M0: length 3.4
  Bottom Layer w0.254: DIV1.1 50.25,20.74 MR1.7
1M1: length 9.5
  Bottom Layer w0.254: DIV1.2 53.64,17.44 52.96,16.76 51.56,16.76 47.71,20.62 MR1.6
1M2: length 13.6
  Bottom Layer w0.254: MR1.5 45.17,21.13 50.16,16.13 53.72,16.13 54.91,17.32 DIV1.3
2M0: length 3.4
  Bottom Layer w0.254: MR2.7 62.04,26.72 DIV2.1
2M1: length 9.1
  Bottom Layer w0.254: DIV2.2 65.23,30.02 65.79,29.46 65.79,28.32 61.65,24.18 MR2.6
2M2: length 13.2
  Bottom Layer w0.254: MR2.5 66.29,26.41 66.29,30.23 65.23,31.29 DIV2.3
3M0: length 3.2
  Bottom Layer w0.254: MR3.7 61.95,53.34 DIV3.1
3M1: length 9
  Bottom Layer w0.254: DIV3.2 65.03,56.51 65.53,56.01 65.53,54.48 61.84,50.8 MR3.6
3M2: length 13
  Bottom Layer w0.254: MR3.5 66.04,52.86 66.04,56.77 65.03,57.78 DIV3.3
4M0: length 3.3
  Bottom Layer w0.254: MR4.7 62.03,79.75 DIV4.1
4M1: length 9
  Bottom Layer w0.254: 61.5,77.21 61.84,77.21 65.66,81.03 65.66,82.42 65.09,82.99 DIV4.2
4M2: length 13.1
  Bottom Layer w0.254: DIV4.3 65.09,84.26 66.17,83.19 66.17,79.33 MR4.5
A1/1: length 5.8
  Bottom Layer w1.27: M1.1 40.19,12.01 42.63,9.57 ML1.4
A1/2: length 5.9
  Bottom Layer w1.27: ML2.4 73.31,19.1 70.84,16.62 M2.1
A1/3: length 5.9
  Bottom Layer w1.27: ML3.4 72.89,45.72 70.41,43.23 M3.1
A1/4: length 5.8
  Bottom Layer w1.27: 74.2,72.13 73.02,72.13 70.61,69.72 M4.1
A2/1: length 5.8
  Top Layer w1.27: ML1.3 40.09,9.61 42.69,12.21 M1.2
A2/2: length 5.9
  Top Layer w1.27: ML2.3 73.1,16.56 70.54,19.12 M2.2
A2/3: length 5.9
  Top Layer w1.27: M3.2 70.47,45.73 73.03,43.18 ML3.3
A2/4: length 5.8
  Top Layer w1.27: M4.2 70.53,72.22 73.16,69.59 ML4.3
AIN1: length 16.4
  Top Layer w0.254: TBR.3 18.54,53.34 23.11,57.91 L.12
  Top Layer w0.508: L.12 L0.9
AIN2: length 16.4
  Top Layer w0.254: L.13 25.15,60.45 20.57,55.88 TBR.2
  Top Layer w0.508: L0.8 L.13
AO1: length 5.7
  Top Layer w1.27: TBL.4 3.56,50.8 4.55,51.8 MA.1
AO2: length 5.7
  Top Layer w1.27: MA.2 5.23,49.3 4.19,48.26 TBL.5
B1/1: length 4.8
  Top Layer w1.27: M1.3 45.19,8.49 ML1.5
B1/2: length 4.8
  Top Layer w1.27: M2.3 74.2,21.62 ML2.5
B1/3: length 4.8
  Top Layer w1.27: M3.3 74.11,48.23 ML3.5
B1/4: length 4.8
  Top Layer w1.27: M4.3 74.16,74.72 ML4.5
B2/1: length 4.7
  Top Layer w1.27: ML1.6 47.69,8.48 M1.4
B2/2: length 4.9
  Top Layer w1.27: M2.4 74.16,24.12 ML2.6
B2/3: length 4.9
  Top Layer w1.27: ML3.6 74.07,50.73 M3.4
B2/4: length 4.8
  Top Layer w1.27: M4.4 74.2,77.22 74.2,77.21
BIN1: length 16.8
  Top Layer w0.254: L.6 22.73,42.67 TBR.5
  Top Layer w0.508: L0.15 L.6
BIN2: length 16.8
  Top Layer w0.254: TBR.6 19.05,45.72 24.64,40.13 L.5
  Top Layer w0.508: L0.16 L.5
BO1: length 6
  Top Layer w1.27: MB.2 5.19,41.55 3.56,43.18 TBL.7
BO2: length 6
  Top Layer w1.27: TBL.6 3.94,45.72 5.61,44.05 MB.1
DIR1: length 39.1
  Top Layer w0.254: MR1.1 35.01,22.18 37.08,24.26 37.08,40.51 R0.9
  Top Layer w0.508: R0.9 R.12
DIR2: length 50.4
  Top Layer w0.254: MR2.1 58.67,14.33 v2(58.67,31.37)
  Top Layer w0.508: R0.10 R.11
  Bottom Layer w0.254: v2(58.67,31.37) 58.67,46.1 R.11
DIR3: length 29.3
  Top Layer w0.254: R.10 54.36,52.96 54.36,47.12 59.56,41.91 62.36,41.91 63.12,41.15 63.12,39.78 MR3.1
  Top Layer w0.508: R0.11 R.10
DIR4: length 17.4
  Top Layer w0.254: R.9 53.72,57.91 60.32,64.51 MR4.1
  Top Layer w0.508: R0.12 R.9
ENA: length 32
  Top Layer w0.254: R.16 61.52,30.55 MR2.8
  Top Layer w0.508: R0.5 R.16
  Bottom Layer w0.254: MR1.8 53.04,21.16 61.14,29.26 MR2.8
ENB: length 51
  Top Layer w0.254: MR4.8 64.13,79.66 64.13,58.58 MR3.8 56.1,50.55 v2(56.1,46.58)
  Top Layer w0.508: R0.6 R.15
  Bottom Layer w0.254: R.15 52.2,42.67 v2(56.1,46.58)
FLT1: length 2.3
  Bottom Layer w0.254: R1.2 37.55,9.2 ML1.2
FLT2: length 2.4
  Bottom Layer w0.254: R2.2 72.96,12.76 ML2.2
FLT3: length 2.5
  Bottom Layer w0.254: ML3.2 72.86,39.36 R3.2
FLT4: length 2.4
  Bottom Layer w0.254: R4.2 73.52,67.05 74.2,67.05
K_BAK: length 12.7
  Top Layer w0.508: PANEL.3 31.62,84.5 L0.1 L.20
K_CON: length 34.2
  Top Layer w0.508: L.16 L0.5 41.28,77.72 41.28,85.98 42.04,86.74 46.35,86.74 47.59,85.5 PANEL.9
MISO1: length 41.3
  Top Layer w0.508: L0.12 L.9
  Bottom Layer w0.254: W25Q64.3 11.68,68.07 25.65,54.1 28.57,54.1 29.72,52.96 29.72,51.18 28.83,50.29 L.9
MOSI1: length 41.3
  Top Layer w0.508: L0.13 L.8
  Bottom Layer w0.254: L.8 25.02,49.28 25.02,53.72 W25Q64.6
MV: length 26.6
  Top Layer w2.032: SW.2 22.73,5.08 19.43,1.78 12.48,1.78 VM#2.1 9.49,4.73 VM.1
NSS1: length 29.5
  Top Layer w0.508: L0.10 L.11
  Bottom Layer w0.254: W25Q64.2 14.22,67.69 L.11
PSH: length 23.4
  Top Layer w0.508: PANEL.6 40.09,79.08 L0.4 L.17
RX1: length 11.4
  Top Layer w0.508: L.14 L0.7 33.15,62.99 35.75,65.6 OPENMV.1
SCK1: length 35.3
  Top Layer w0.508: L.10 L0.11
  Bottom Layer w0.254: L.10 26.42,52.83 6.6,72.64 W25Q64.5
SCL2: length 26.8
  Top Layer w0.508: PANEL.7 42.59,69.8 R0.15 R.6
SDA2: length 23.2
  Top Layer w0.508: R.5 R0.16 45.09,69.84 PANEL.8
T2C3: length 33
  Top Layer w0.254: MR1.2 37.55,35.9 R0.7
  Top Layer w0.508: R0.7 R.14
T2C4: length 17.5
  Top Layer w0.254: R.13 52.58,47.75 59.69,40.64 MR3.2
  Top Layer w0.508: R0.8 R.13
T3C3: length 55.5
  Top Layer w0.254: MR2.2 59.44,16.11 v2(59.44,30.48)
  Top Layer w0.508: R0.13 R.8
  Bottom Layer w0.254: R.8 59.44,52.96 v2(59.44,30.48)
T3C4: length 16.3
  Top Layer w0.254: R.7 54.74,62.99 58.8,67.05 61.5,67.05
  Top Layer w0.508: R0.14 R.7
T4C1: length 22.2
  Top Layer w0.508: L0.14 L.7
  Bottom Layer w0.254: TBR.1 24.64,50.93 24.64,47.12 L.7
T4C4: length 16.8
  Top Layer w0.254: TBR.7 20.96,43.18 L.4
  Top Layer w0.508: L0.17 L.4
TBVM: length 32
  Top Layer w1.524: TB.2 14.48,50.67 6.73,58.42 TBL.1
TRA: length 19.9
  Top Layer w0.508: PANEL.5 37.59,79.12 L0.3 L.18
TRB: length 16.3
  Top Layer w0.508: PANEL.4 35.09,79.16 L0.2 L.19
TX1: length 11.3
  Top Layer w0.508: L.15 L0.6
  Bottom Layer w0.508: L0.6 33.15,65.53 35.58,63.1 OPENMV.2
$1N791: length 5.1
  Top Layer w0.508: R0.17 R.4
$1N817: length 5.1
  Top Layer w0.508: R0.4 R.17
$1N819: length 5.1
  Top Layer w0.508: R0.3 R.18
$1N821: length 5.1
  Top Layer w0.508: R0.2 R.19
$1N823: length 5.1
  Top Layer w0.508: R0.1 R.20
$1N12146: length 1.6
  Bottom Layer w0.254: FLT1.1 36.43,13.42 R1.1
$1N12296: length 1.7
  Bottom Layer w0.254: R2.1 70.83,12.75 FLT2.1
$1N12394: length 1.6
  Bottom Layer w0.254: FLT3.1 69.02,39.36 R3.1
$1N12492: length 1.6
  Bottom Layer w0.254: R4.1 69.17,65.84 FLT4.1

## Copper pours and planes (outline as drawn; the poured copper is in the pictures)
GND on Top Layer: -0.89,89.28 83.57,89.28 83.57,-1.14 -0.89,-1.14
GND on Bottom Layer: -0.89,89.28 83.57,89.28 83.57,-1.14 -0.89,-1.14

Small or netless copper shapes (teardrops, artwork), in the pictures only: 179 on Top Layer, 122 on Bottom Layer

## Text on the board
Bottom Silkscreen Layer: A+ | A- | B+ | B-
Top Silkscreen Layer: GND | +5V | VM | PWMA | PWMB | KCON | MISO1 | MOSI1 | TRA | PSH | U1TX | U1RX | AIN2 | AIN1 | NSS1 | SCK1 | BIN1 | BIN2 | VCC | RST | STP4 | STP2 | DIR4 | DIR3 | DIR2 | DIR1 | STP3 | STP1 | ENB | ENA | VIN | KBAK | TRB | SDA2 | SCL2 | VMOT | TB6612 | STM32 | DRV8825 | 2024/10/2 | GZ CRAFTED | 5V供电 | Ciallo～(∠・ω< )⌒★ | 电源
